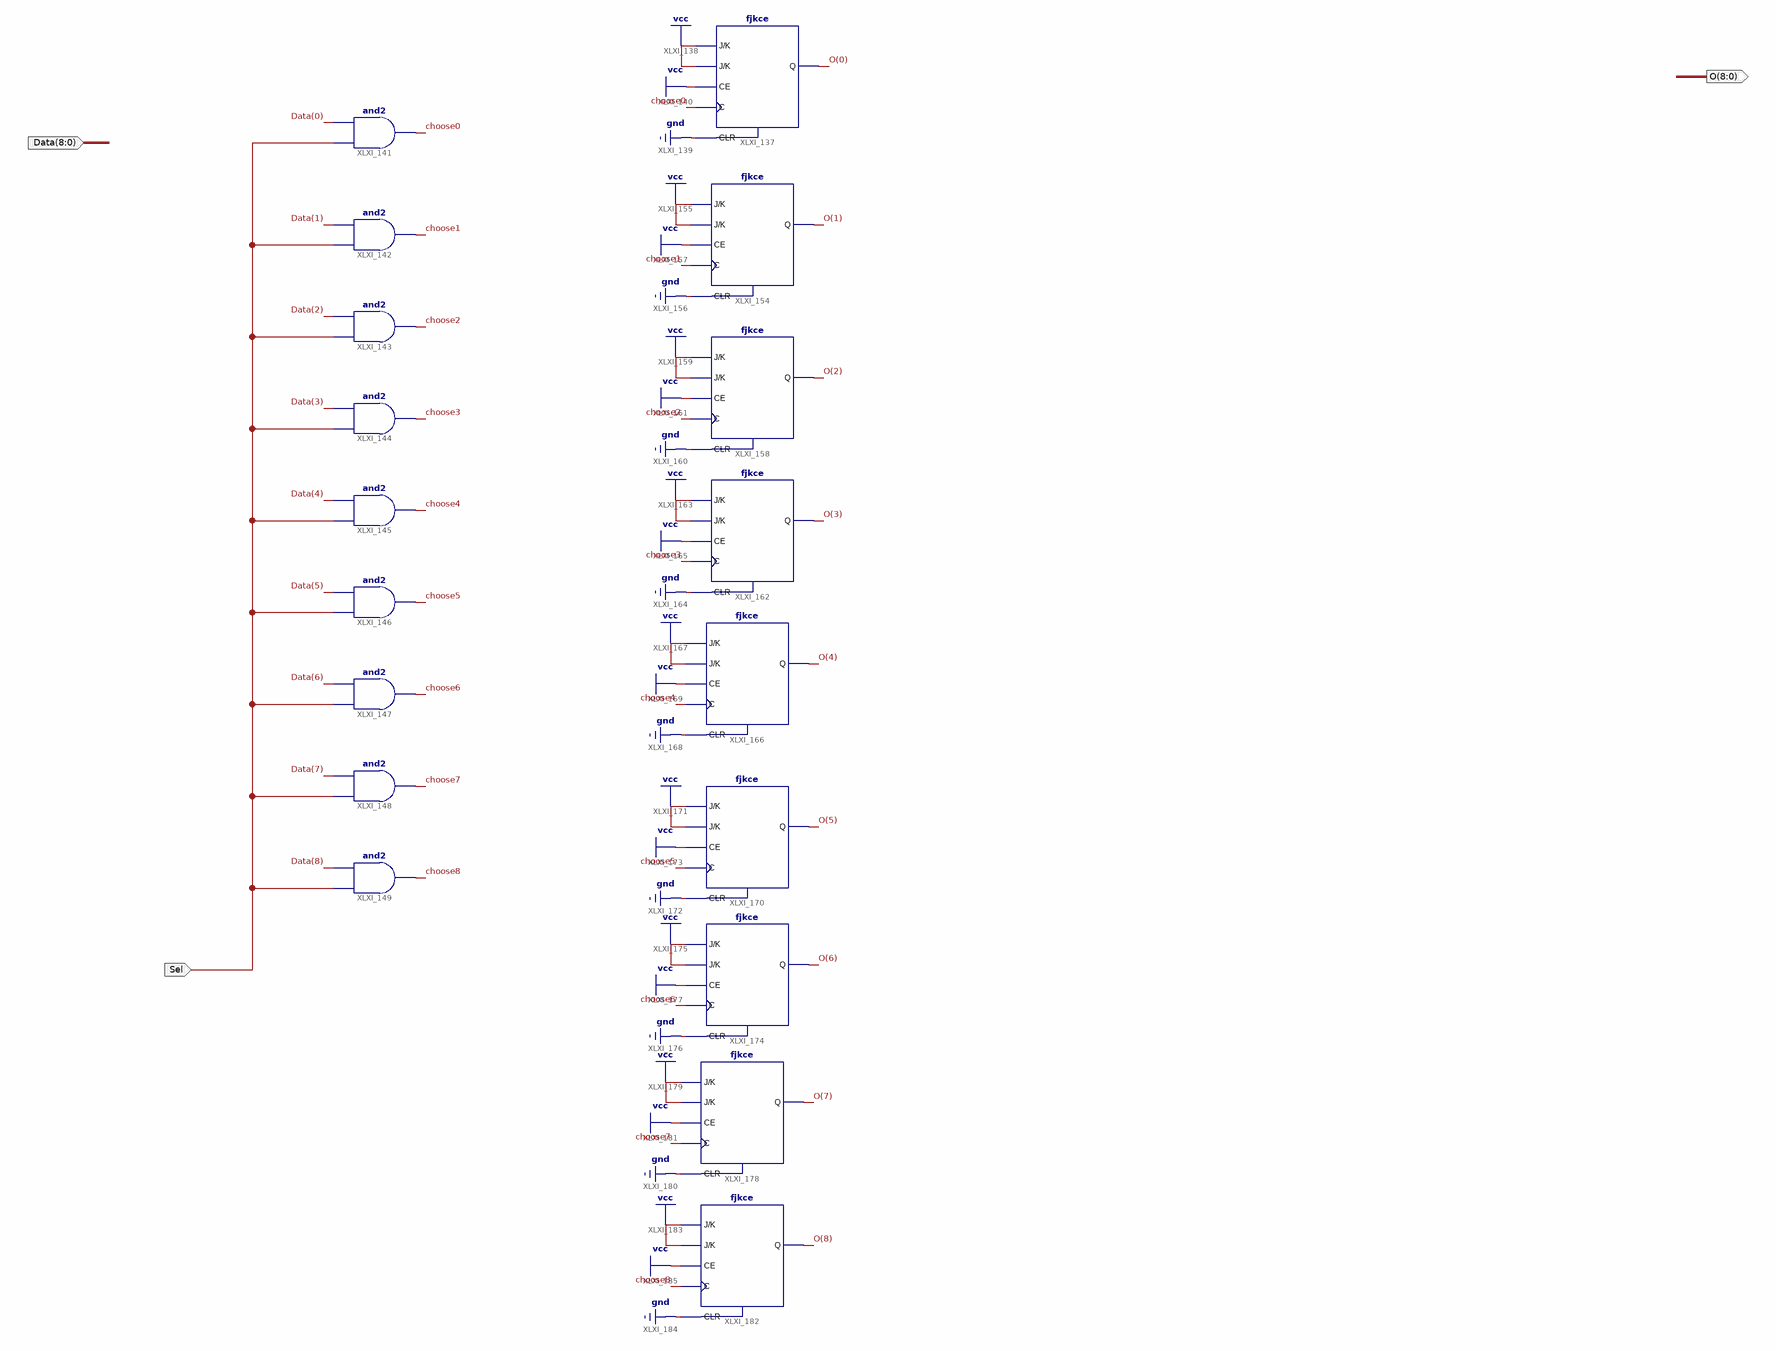
[diagram p0: schematic sheet 1]
// Xilinx ISE schematic ChooseLED.sch (spartan6) as structural Verilog: 18 symbols, 3 ports
module ChooseLED (
  input  [8:0] Data,
  input  Sel,
  output [8:0] O
);

  wire choose0, choose1, choose2, choose3, choose4, choose5, choose6, choose7, choose8;

  and XLXI_141 (choose0, Sel, Data[0]);
  and XLXI_142 (choose1, Sel, Data[1]);
  and XLXI_143 (choose2, Sel, Data[2]);
  and XLXI_144 (choose3, Sel, Data[3]);
  and XLXI_145 (choose4, Sel, Data[4]);
  and XLXI_146 (choose5, Sel, Data[5]);
  and XLXI_147 (choose6, Sel, Data[6]);
  and XLXI_148 (choose7, Sel, Data[7]);
  and XLXI_149 (choose8, Sel, Data[8]);
  fjkce XLXI_137 (.C(choose0), .CE(1'b1), .CLR(1'b0), .J(1'b1), .K(1'b1), .Q(O[0]));
  fjkce XLXI_154 (.C(choose1), .CE(1'b1), .CLR(1'b0), .J(1'b1), .K(1'b1), .Q(O[1]));
  fjkce XLXI_158 (.C(choose2), .CE(1'b1), .CLR(1'b0), .J(1'b1), .K(1'b1), .Q(O[2]));
  fjkce XLXI_162 (.C(choose3), .CE(1'b1), .CLR(1'b0), .J(1'b1), .K(1'b1), .Q(O[3]));
  fjkce XLXI_166 (.C(choose4), .CE(1'b1), .CLR(1'b0), .J(1'b1), .K(1'b1), .Q(O[4]));
  fjkce XLXI_170 (.C(choose5), .CE(1'b1), .CLR(1'b0), .J(1'b1), .K(1'b1), .Q(O[5]));
  fjkce XLXI_174 (.C(choose6), .CE(1'b1), .CLR(1'b0), .J(1'b1), .K(1'b1), .Q(O[6]));
  fjkce XLXI_178 (.C(choose7), .CE(1'b1), .CLR(1'b0), .J(1'b1), .K(1'b1), .Q(O[7]));
  fjkce XLXI_182 (.C(choose8), .CE(1'b1), .CLR(1'b0), .J(1'b1), .K(1'b1), .Q(O[8]));
endmodule
